# Altium schematic sheet MAZ000179 - Diagrama eléctrico.SchDoc: MAZ000179 - Diagrama eléctrico
size A; ApprovedBy: Christian Ledwidth; CheckedBy: Nahuel Martinez; Author: Santiago Marti; CompanyName: Body Health; DrawnBy: Santiago Marti; Revision: A; SheetNumber: 1; SheetTotal: 2
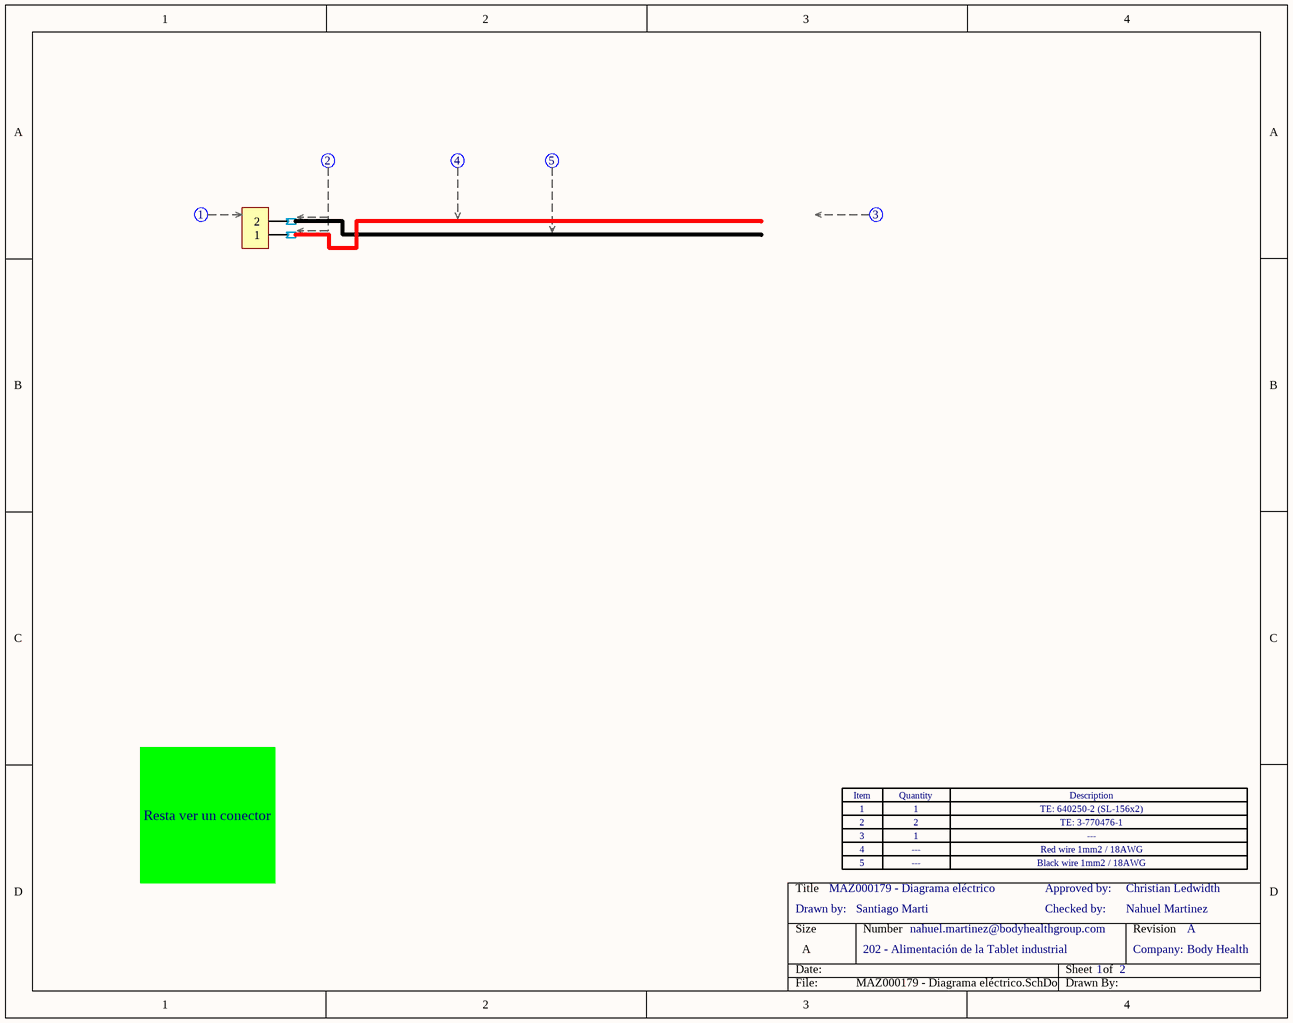
[diagram p0: MAZ000179 - Diagrama eléctrico.SchDoc]

## Parts
Con1  SL156-2  (value not drawn)  (parts C,D of 4)
Con2  SL156-2  (value not drawn)  (part C of 4)
Soc1  sock_SL156_770476-1  (value not drawn)  (parts A,B of 2)
Soc2  sock_SL156_770476-1  (value not drawn)  (part A of 2)
Soc3  sock_SL156_770476-1  (value not drawn)  (parts A,B of 2)
Zoc1  Zócalo_Header  (value not drawn)
Zoc2  Zócalo_Item  (value not drawn)
Zoc3  Zócalo_Item  (value not drawn)
Zoc4  Zócalo_Item  (value not drawn)
Zoc5  Zócalo_Item  (value not drawn)
Zoc?  Zócalo_Item  (value not drawn)

## Nets
NetCon1_1: Con1.1 Soc3.0
NetCon1_2: Con1.2 Soc1.0

Not connected (* = marked no-connect by the designer): Soc1 1; Soc3 1

## Notes on the sheet
- Resta ver un conector
- 1
- 2
- 3
- TE: 640250-2 (SL-156x2)
- TE: 3-770476-1
- ---
- Drawn by:
- 4
- 5
- Checked by:
- Approved by:
- Red wire 1mm2 / 18AWG
- Black wire 1mm2 / 18AWG
- 202 - Alimentación de la Tablet industrial
- nahuel.martinez@bodyhealthgroup.com
- Company:
- (in symbol Zócalo_Header) Item; Quantity; Description

## Library data of the parts
Con1 = SL156-2: CONN RECEPT 2 POS W/RAMP SL-156; Cod.Fabricante: 640250-2; Fabricante: TE Connectivity AMP Connectors; CallOut: 1; Cod.DigiKey: A19950-ND; ComponentLink1Description: Manufacturer Link; ComponentLink1URL: https://www.te.com/commerce/DocumentDelivery/DDEController?Action=srchrtrv&DocNm=640250&DocType=Customer+Drawing&DocLang=English; DIGIKEYx50: 0.11420; DIGIKEYx100: NO
Con2 = SL156-2: CONN RECEPT 2 POS W/RAMP SL-156; Cod.Fabricante: 640250-2; Fabricante: TE Connectivity AMP Connectors; CallOut: 3; Cod.DigiKey: A19950-ND; ComponentLink1Description: Manufacturer Link; ComponentLink1URL: https://www.te.com/commerce/DocumentDelivery/DDEController?Action=srchrtrv&DocNm=640250&DocType=Customer+Drawing&DocLang=English; DIGIKEYx50: 0.11420; DIGIKEYx100: NO
Soc1 = sock_SL156_770476-1: CONN SOCKET 18-24AWG CRIMP TIN; Fabricante: TE Connectivity AMP Connectors; CallOut: 2; Cod.DigiKey: A19993CT-ND; Cod.Fabricante: 770476-1; ComponentLink1Description: Manufacturer Link; ComponentLink1URL: https://www.te.com/commerce/DocumentDelivery/DDEController?Action=srchrtrv&DocNm=770476&DocType=Customer+Drawing&DocLang=English; DIGIKEYx100: 0.08690; DIGIKEYx50: 0.08180
Soc2 = sock_SL156_770476-1: CONN SOCKET 18-24AWG CRIMP TIN; Fabricante: TE Connectivity AMP Connectors; CallOut: 4; Cod.DigiKey: A19993CT-ND; Cod.Fabricante: 770476-1; ComponentLink1Description: Manufacturer Link; ComponentLink1URL: https://www.te.com/commerce/DocumentDelivery/DDEController?Action=srchrtrv&DocNm=770476&DocType=Customer+Drawing&DocLang=English; DIGIKEYx100: 0.08690; DIGIKEYx50: 0.08180
Soc3 = sock_SL156_770476-1: CONN SOCKET 18-24AWG CRIMP TIN; Fabricante: TE Connectivity AMP Connectors; CallOut: 5; Cod.DigiKey: A19993CT-ND; Cod.Fabricante: 770476-1; ComponentLink1Description: Manufacturer Link; ComponentLink1URL: https://www.te.com/commerce/DocumentDelivery/DDEController?Action=srchrtrv&DocNm=770476&DocType=Customer+Drawing&DocLang=English; DIGIKEYx100: 0.08690; DIGIKEYx50: 0.08180
Zoc1 = Zócalo_Header: Header para el zócalo de referencias
Zoc2-Zoc5 Zoc? = Zócalo_Item: Ítem para el zócalo de referencias; Desginator: *; Quantity: *; ItemDescription: *